# Altium schematic sheet 3_IMD.SchDoc
size A4; SheetNumber: 3; SheetTotal: 7
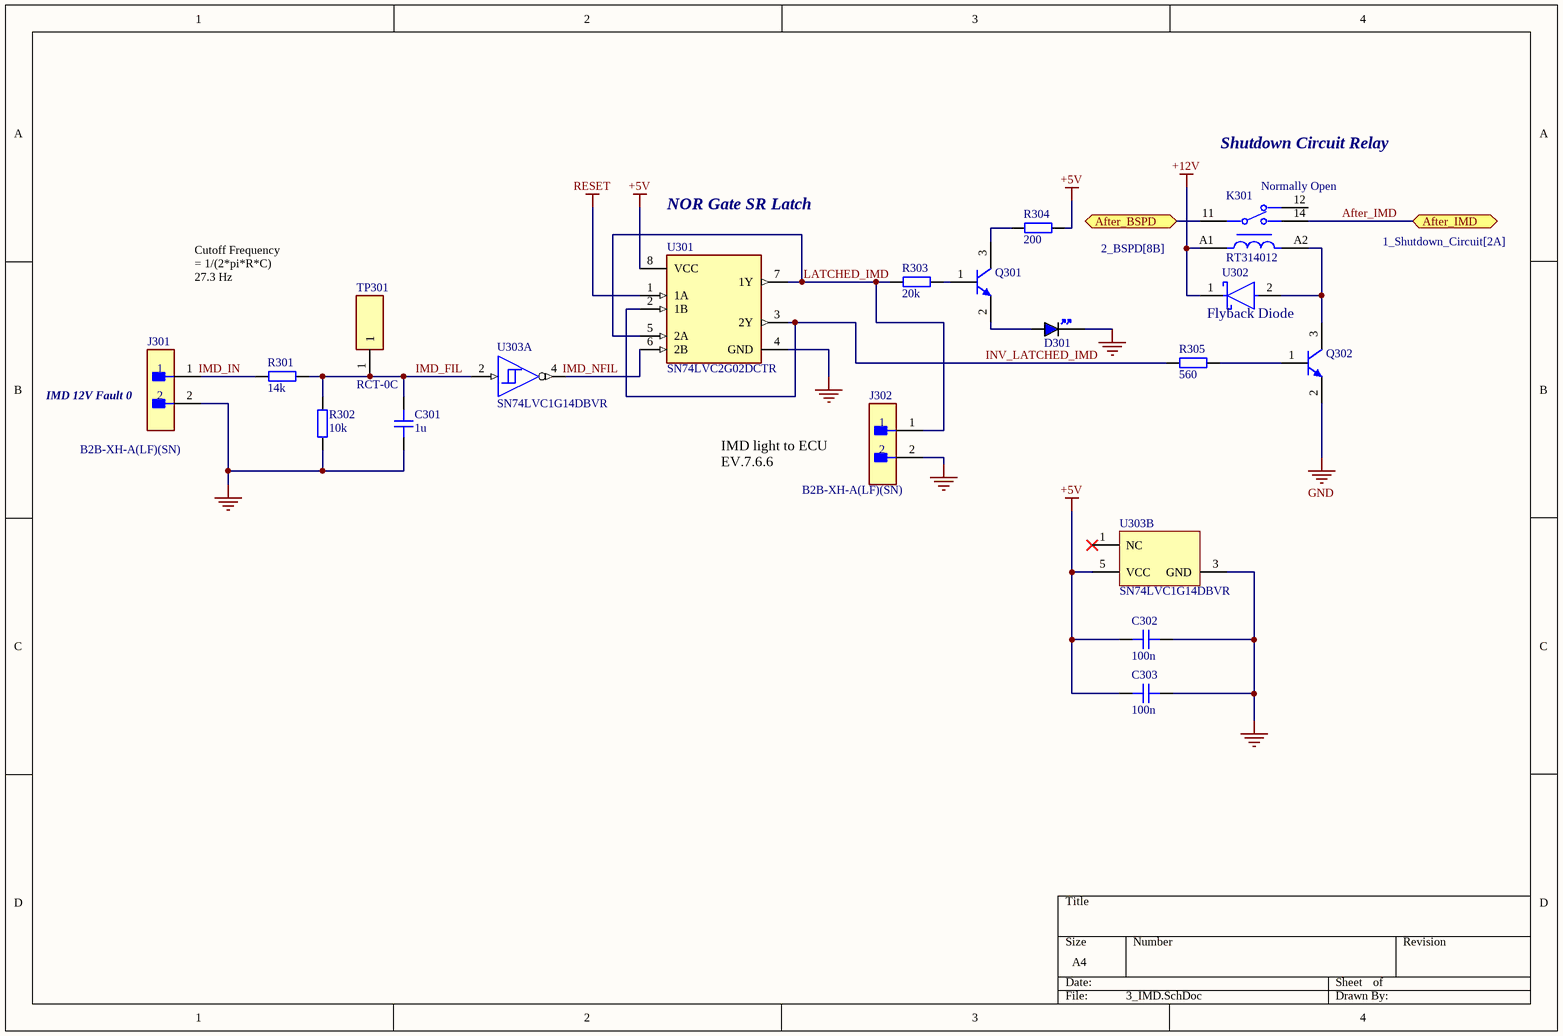
[diagram p0: 3_IMD.SchDoc]

## Parts
C301  1u  [CAP_0805]
C302  100n  [CAP_0805]
C303  100n  [CAP_0805]
D301  BLUE  [LED_0805_BLUE]  (value not drawn)
J301  B2B-XH-A(LF)(SN)  [FP-B2B-XH-A_LF_SN-MFG]
J302  B2B-XH-A(LF)(SN)  [FP-B2B-XH-A_LF_SN-MFG]
K301  RT314012  [FP-RT314012-MFG]
Q301  MMBT5550LT1G  [ONSC-SOT-23-3-318-08_V]  (value not drawn)
Q302  MMBT5550LT1G  [ONSC-SOT-23-3-318-08_V]  (value not drawn)
R301  14k  [RES_0805]
R302  10k  [RES_0805]
R303  20k  [RES_0805]
R304  200  [RES_0805]
R305  560  [RES_0805]
TP301  RCT-0C  [RCT-0C]
U301  SN74LVC2G02DCTR  [FP-DCT0008A-IPC_A]
U302  BAT54JFILM  [FP-SOD323-MFG]  (value not drawn)
U303  SN74LVC1G14DBVR  [DBV0005A_L]  (parts A,B of 2)

## Ports
After_BSPD (bidir, see 2_BSPD[8B]), After_IMD (bidir, see 1_Shutdown_Circuit[2A])

## Nets
+5V: C302.1 C303.1 R304.2 U301.8(VCC) U303.5(VCC)
+12V: K301.A1 U302.1(C)
GND: C301.1 C302.2 C303.2 D301.K J301.2 J302.2 Q302.2(E) R302.1 U301.4(GND) U303.3(GND)
RESET: U301.1(1A)
After_BSPD: K301.11 ; port After_BSPD
After_IMD: K301.14 ; port After_IMD
IMD_FIL: C301.2 R301.2 R302.2 TP301.1 U303.2(A)
IMD_IN: J301.1 R301.1
IMD_NFIL: U301.6(2B) U303.4(Y)
INV_LATCHED_IMD: R305.1 U301.2(1B) U301.3(2Y)
LATCHED_IMD: J302.1 R303.2 U301.5(2A) U301.7(1Y)
NetD301_A: D301.A Q301.2(E)
NetK301_A2: K301.A2 Q302.3(C) U302.2(A)
NetQ301_1: Q301.1(B) R303.1
NetQ301_3: Q301.3(C) R304.1
NetQ302_1: Q302.1(B) R305.2

Not connected (* = marked no-connect by the designer): K301 12; U303 1(NC)*

## Notes on the sheet
- Shutdown Circuit Relay
- NOR Gate SR Latch
- (near K301) Normally Open
- Cutoff Frequency = 1/(2*pi*R*C)
  27.3 Hz
- (near U302) Flyback Diode
- (near J301) IMD 12V Fault 0
- IMD light to ECU
  EV.7.6.6

## Library data of the parts
C301-C303 = CAP_0805: Capacitor SMD 0805; Manufacturer: *; Manufacturer Part Number: *; Distributor Link: *; LCSC: *; Rating: *; Dielectric: *
D301 = LED_0805_BLUE: LED 0805 BLUE SMD; Manufacturer: *; Manufacturer Part Number: *; Distributor Link: *; LCSC: *
J301 J302 = CMP-2000-05888-3: CONN HEADER VERT 2POS 2.5MM; Current Rating: 3A; Voltage Rating: 250V; Number of Contacts: 2; Contact Resistance: 20mR; Wire/Cable Gauge: 22AWG; Insulation Resistance: 1GR; Connector Type: Male Pin; Packaging: Bulk; Contact Material: Brass; Lead Free: Lead Free; Orientation: Straight; Contact Plating: Tin; Max Current Rating: 3A; Termination: Solder; Fastening Type: Detent; Depth: 5.75mm; Housing Material: Polyamide; REACH SVHC: No SVHC; Series: XH; Voltage Rating (AC): 250V; Number of Positions: 2; Color: Natural; Contact Type: Male Pin; Max Voltage Rating (DC): 250V; Pitch: 2.5mm; Lead Pitch: 2.5mm; Mount: Through Hole; Max Operating Temperature: 85°C; Length: 7.4mm; Max Voltage Rating (AC): 250V; Min Operating Temperature: -25°C; Number of Rows: 1; Housing Color: White
K301 = CMP-03395-000105-1: RELAY GEN PURPOSE SPDT 16A 12V; Manufacturer: TE Connectivity; Coil Type: Non-Latching; Number Of Contacts: 1; Coil Power: 400mW; Coil Resistance: 360Ω; Device Class L2: Relays; Digikey Description: RELAY GEN PURPOSE SPDT 16A 12V; Coil Voltage: 12V; RoHS: TRUE; Category: Relay; Lead Free: Yes; Manufacturer Part Number: RT314012; ComponentLink2Description: Datasheet; Throw Configuration: SPDT; Current Rating: 16A; Ambient Temperature Range Low: -40°C; ComponentLink2URL: https://www.te.com/commerce/DocumentDelivery/DDEController?Action=showdoc&DocId=Data+Sheet%7FRT1%7F0219%7Fpdf%7FEnglish%7FENG_DS_RT1_0219.pdf%7F9-1393239-5; Automotive: No; Device Class L1: Electromechanical; Octopart: https://octopart.com/9-1393239-5-te+connectivity-46509288; Ambient Temperature Range High: +85°C; Height: 15.7mm; Package: RT314012; Device Class L3: Power Relays
Q301 Q302 = CMP-1048-00659-1: High Voltage Transistor, NPN Silicon, 3-Pin SOT-23, Pb-Free, Tape and Reel; Manufacturer: On Semiconductor; IC Continuous (A): 0.6; PackageDescription: 3-Pin Small Outline Transistor, Body 2.92 x 1.3 mm, Pitch 0.95 mm; ComponentLink3URL: http://www.onsemi.cn/pub_link/Collateral/318-08.PDF; RoHS: TRUE; ComponentLink2URL: http://www.onsemi.cn/pub_link/Collateral/MMBT5550LT1-D.PDF; DatasheetVersion: Rev. 10; ComponentLink1URL: http://www.onsemi.com/; PackageReference: SOT-23-3-318-08; PackageVersion: Rev. AP, 11/2009; Mounting Technology: Surface Mount; ComponentLink2Description: Datasheet; PartNumber: MMBT5550LT1G; ComponentLink3Description: Package Specification; Packing: Tape and Reel; Polarity: NPN; ComponentLink1Description: Manufacturer URL
R301-R305 = RES_0805: Resistor SMD 0805; Manufacturer: *; Manufacturer Part Number: *; Distributor Link: *; LCSC: *
TP301 = RCT-0C: Test Point; Manufacturer_Name: TE Connectivity; Datasheet Link: https://www.te.com/commerce/DocumentDelivery/DDEController?Action=srchrtrv&DocNm=1773266&DocType=Data%20Sheet&DocLang=English&PartCntxt=1625854-2&DocFormat=pdf; Manufacturer_Part_Number: RCT-0C; Mouser Part Number: 279-RCT-0C; Mouser Price/Stock: https://www.mouser.co.uk/ProductDetail/TE-Connectivity-Holsworthy/RCT-0C?qs=ip69W3eHERWzZOsRKmFYAw%3D%3D; Arrow Part Number: RCT-0C; Arrow Price/Stock: https://www.arrow.com/en/products/rct-0c/te-connectivity?region=nac
U301 = CMP-0859-00563-4: IC GATE NOR 2CH 2-INP SM8; Number of Outputs: 1; High Level Output Current: -32mA; Number of Bits: 2; Max Supply Voltage: 5.5V; Turn-On Delay Time: 4.4ns; Min Supply Voltage: 1.65V; Low Level Output Current: 32mA; Operating Supply Voltage: 3.3V; Quiescent Current: 10uA; Logic Function: NOR GATE; Max Operating Temperature: 125°C; Radiation Hardening: No; Number of Pins: 8; Lead Free: Lead Free; Packaging: Tape and Reel; Number of Gates: 2; Package Quantity: 1; Number of Elements: 2; REACH SVHC: No SVHC; Max Output Current: 32mA; Propagation Delay: 4.4ns; Termination: SMD/SMT; Number of Inputs: 2; Mount: Surface Mount; Output Current: 32mA; Case/Package: SSOP; Min Operating Temperature: -40°C; Weight: 0.000825oz; Number of Circuits: 2; Number of Output Lines: 1; RoHS Compliant: Yes; Number of Input Lines: 2
U302 = CMP-2000-05927-2: DIODE SCHOTTKY 40V 300MA SOD323; Manufacturer: STMicroelectronics; Max Surge Forward Current: 1.25A; Value: 7pF; Max Junction Temp: +150°C; Peak Reverse Current: 1uA; Standoff Height: 0mm; ComponentLink2Description: Datasheet; Device Class L2: Diodes; Mouser Description: Schottky Diodes & Rectifiers 300mA 40 Volt; Forward Current: 300mA; Temperature Range Low: -40°C; Temperature Range High: +150°C; Digikey Description: DIODE SCHOTTKY 40V 300MA SOD323; Capacitance: 7pF; Ipc Land Pattern Name: SOD250128X117-2; Automotive: No; Manufacturer Part Number: BAT54JFILM; Device Class L1: Discrete Semiconductors; Lead Free: Yes; ComponentLink2URL: https://www.st.com/resource/en/datasheet/bat54.pdf; Package: SOD323; Temperature: -40°C to +150°C; Category: IC; Height: 1.17mm; Octopart: https://octopart.com/bat54jfilm-stmicroelectronics-326073; RoHS: TRUE; Device Class L3: Schottky Diodes; Max Repetitive Reverse Voltage: 40V
U303 = CMP-0859-00030-4: Single Schmitt-Trigger Inverter, DBV0005A, LARGE T&R; Manufacturer: Texas Instruments; Input Type: CMOS/TTL; Output Drive (IOL/IOH)(Max)(mA): 32/-32; VCC(Min)(V): 1.65; 3-State Output: No; Schmitt Trigger: Yes; tpd @ Nom Voltage(Max)(ns): 11,6.5,5.5,5; VCC(Max)(V): 5.5; Output Type: CMOS; Bits(#): 1; Voltage(Nom)(V): 1.8,2.5,3.3,5; Sub-Family: Inverting Buffer/Driver; Logic: Inverting; Technology Family: LVC; F @ Nom Voltage(Max)(Mhz): 150; Rating: Catalog; ICC @ Nom Voltage(Max)(mA): 0.01; DatasheetVersion: SCES218W; PackageReference: DBV0005A; Generic Part Number: SN74LVC1G14; Operating Temperature Range(C): -40 to 125,-40 to 85